# EAGLE schematic CV Recorder (EAGLE 9.6.2)
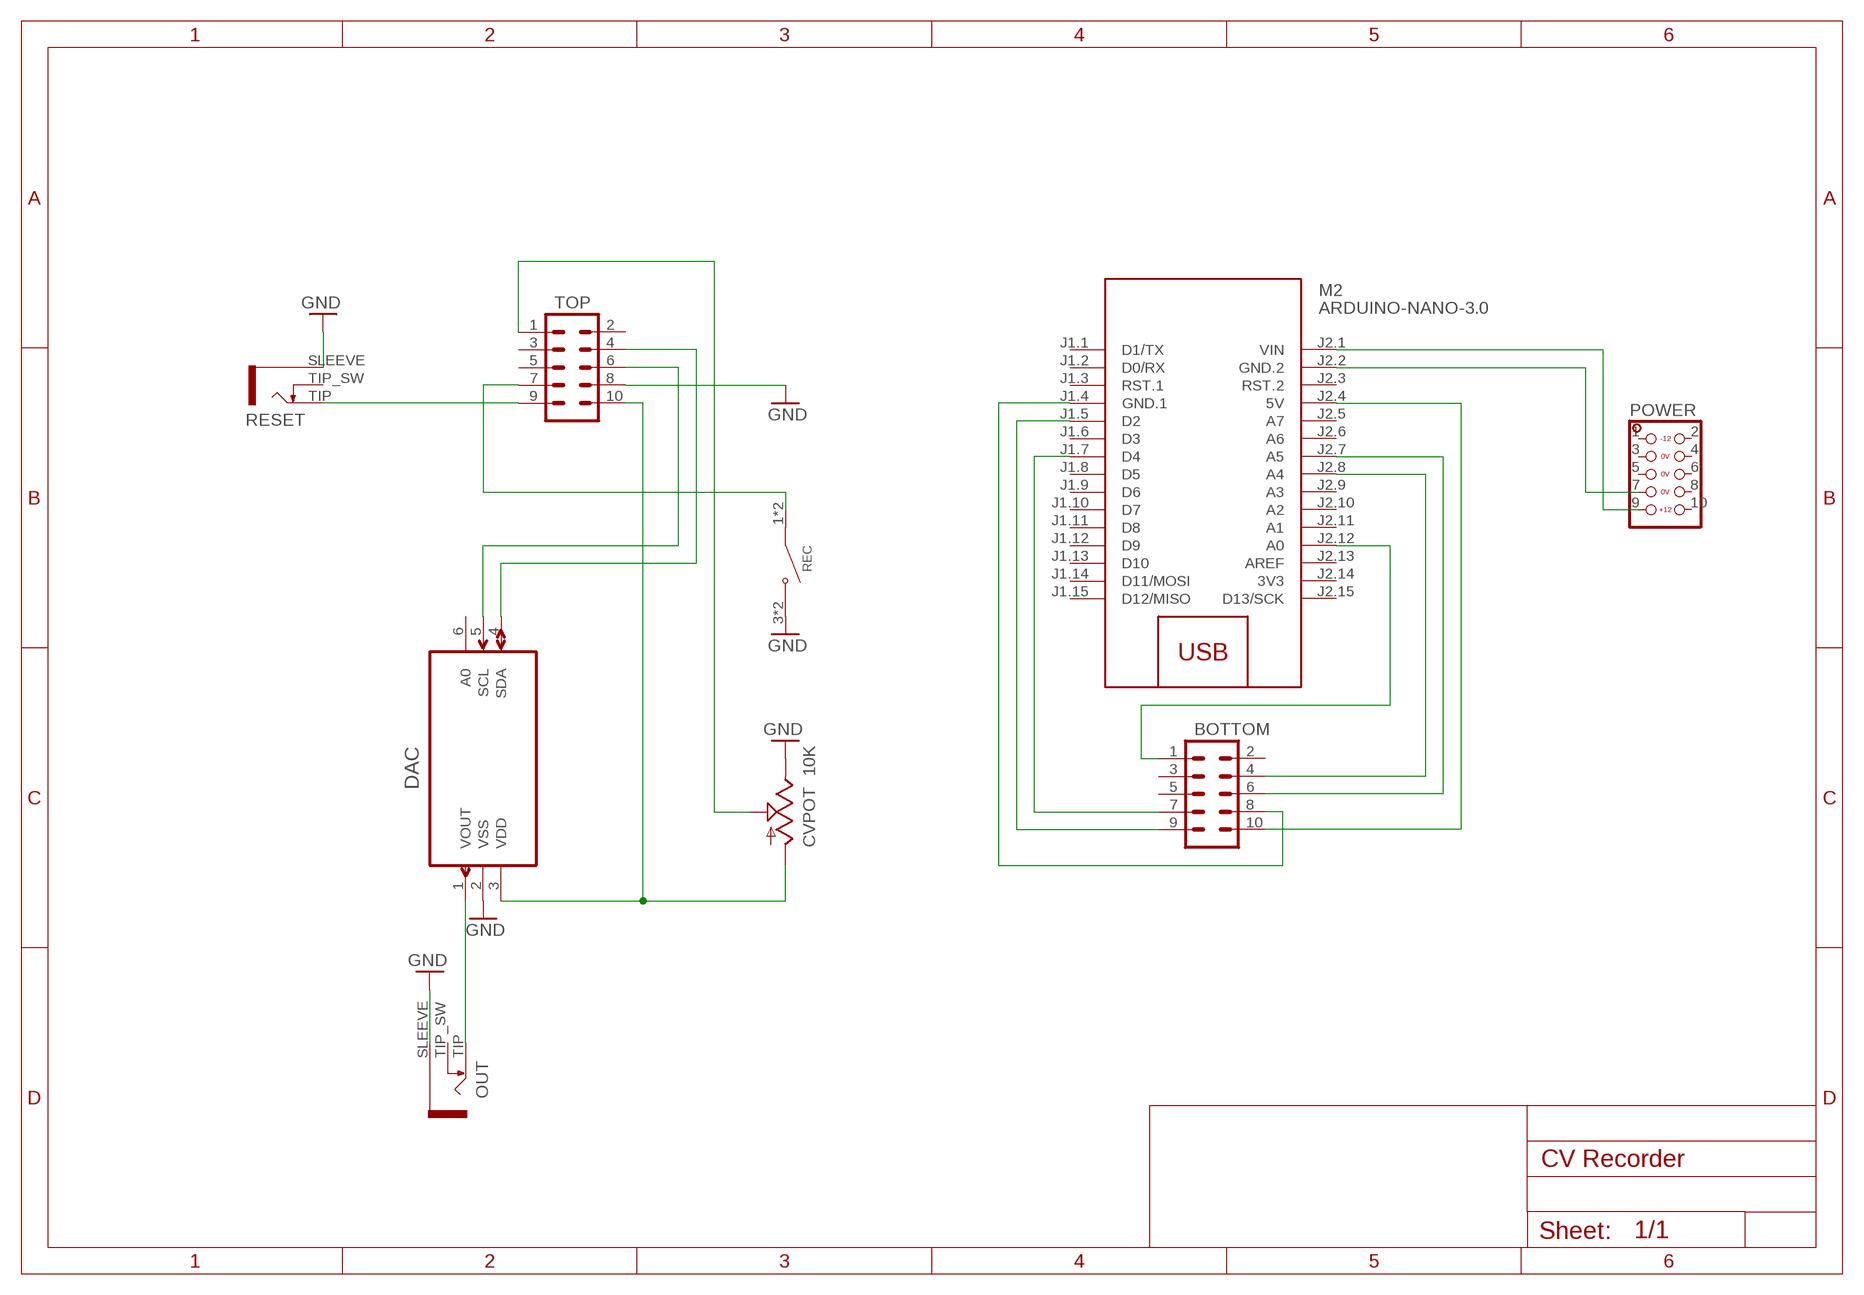
[diagram p0: schematic, sheet 1]

## Parts
BOTTOM  M05X2PTH  [2X5]
CVPOT  10K  POT  [ALPS_POT]
DAC  MCP4725A0T-E/CH  [SOT95P270X145-6N]
M2  ARDUINO-NANO-3.0  [ARDUINO-NANO-3.0]
OUT  JACK-3_5MM-MONO-SW-ALT  [WQP_PJ301M_ALT]
POWER  EUROPWR_2X05-OPEN  [2X05_EUROPWR_OPEN]
REC  D6R90_F1_LFS  [SW_D6R90_F1_LFS]
RESET  JACK-3_5MM-MONO-SW-ALT  [WQP_PJ301M_ALT]
TOP  M05X2PTH  [2X5]

## Nets
GND: CVPOT.P$1 DAC.2(VSS) OUT.SLEEVE REC.3(NO) REC.4(NO) RESET.SLEEVE TOP.8
N$1: M2.J2.1(VIN) POWER.9
N$2: M2.J2.2(GND.2) POWER.7
N$3: DAC.1(VOUT) OUT.TIP
N$4: CVPOT.P$3 DAC.3(VDD) TOP.10
N$5: RESET.TIP TOP.9
N$6: REC.1(COM) REC.2(COM) TOP.7
N$7: CVPOT.P$2 TOP.1
N$8: DAC.5(SCL) TOP.6
N$9: BOTTOM.10 M2.J2.4(5V)
N$10: BOTTOM.8 M2.J1.4(GND.1)
N$11: BOTTOM.6 M2.J2.7(A5)
N$12: BOTTOM.4 M2.J2.8(A4)
N$13: BOTTOM.1 M2.J2.12(A0)
N$14: BOTTOM.7 M2.J1.7(D4)
N$15: DAC.4(SDA) TOP.4
N$16: BOTTOM.9 M2.J1.5(D2)
Unconnected: BOTTOM.2 BOTTOM.3 BOTTOM.5 DAC.6(A0) M2.J1.1(D1/TX) M2.J1.2(D0/RX) M2.J1.3(RST.1) M2.J1.6(D3) M2.J1.8(D5) M2.J1.9(D6) M2.J1.10(D7) M2.J1.11(D8) M2.J1.12(D9) M2.J1.13(D10) M2.J1.14(D11/MOSI) M2.J1.15(D12/MISO) M2.J2.3(RST.2) M2.J2.5(A7) M2.J2.6(A6) M2.J2.9(A3) M2.J2.10(A2) M2.J2.11(A1) M2.J2.13(AREF) M2.J2.15(D13/SCK) OUT.TIP_SW POWER.1 POWER.2 POWER.3 POWER.4 POWER.5 POWER.6 POWER.8 POWER.10 RESET.TIP_SW TOP.2 TOP.3 TOP.5

## Power pins joined to a net without a drawn wire
3V3: M2.J2.14(3V3)

## Library data of the parts
BOTTOM TOP = halcyonmod_Connectors:M05X2: Rectangular Header 0.1" 5x2
CVPOT = halcyonmod_Potentiometers:POT; PROD_ID: RES-09177
DAC = GD_MCP4725:MCP4725A0T-E/CH: 12-Bit Digital-to-Analog Converter with EEPROM; MPN: MCP4725A0T-E/CH; OC_FARNELL: 1578449; OC_NEWARK: 77M3032; PACKAGE: SOT-23-6; SUPPLIER: Microchip
M2 = diy-modules:ARDUINO-NANO-3.0: Arduino Nano 3.0 and compatible devices More details available here: https://www.arduino.cc/en/Main/ArduinoBoardNano Click here to find device on ebay.com <http://www.ebay.com/sch/arduino+nano>
OUT RESET = halcyonmod_Connectors:JACK-3_5MM-MONO-SW: Jack, 3.5mm, RIght Angle, Though-Hole
POWER = halcyonmod_Connectors:EUROPWR_2X05: 2x05 pin header
REC = D6R90_F1_LFS:D6R90_F1_LFS: Pushbutton Switch SPST-NO Keyswitch Through Hole Check prices <https://pricing.snapeda.com/parts/D6R90%20F1%20LFS/C%26K/view-part?ref=eda>; AVAILABILITY: In Stock; DESCRIPTION: Pushbutton Switch SPST-NO Keyswitch Through Hole; MF: C&K; MP: D6R90 F1 LFS; PACKAGE: None; PRICE: None